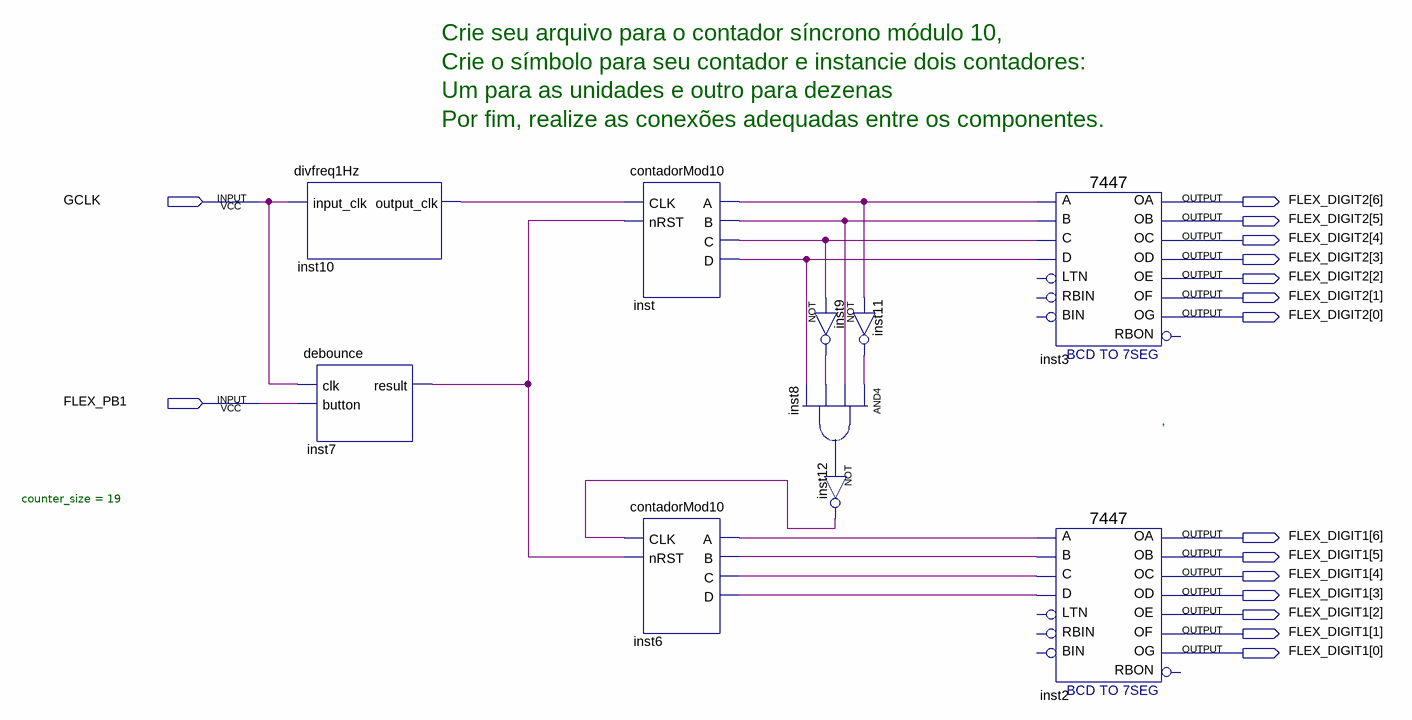
[diagram p0: schematic sheet]
// Quartus schematic Contadores.bdf as structural Verilog: 10 symbols, 16 pins
module Contadores (
  input  GCLK,
  input  FLEX_PB1,
  output [6:0] FLEX_DIGIT2,
  output [6:0] FLEX_DIGIT1
);

  wire inst6_a, inst6_b, inst6_c, inst6_d, inst7_result, inst8_out, inst9_out, inst10_output_clk, inst11_out,
       inst12_out, inst_a, inst_b, inst_c, inst_d;

  divfreq1Hz inst10 (.input_clk(GCLK), .output_clk(inst10_output_clk));
  debounce #(.counter_size(19)) inst7 (.clk(GCLK), .button(FLEX_PB1), .result(inst7_result));
  contadorMod10 inst (.CLK(inst10_output_clk), .nRST(inst7_result), .A(inst_a), .B(inst_b), .C(inst_c), .D(inst_d));
  contadorMod10 inst6 (.CLK(inst12_out), .nRST(inst7_result), .A(inst6_a), .B(inst6_b), .C(inst6_c), .D(inst6_d));
  not inst9 (inst9_out, inst_c);
  and inst8 (inst8_out, inst11_out, inst_b, inst9_out, inst_d);
  not inst12 (inst12_out, inst8_out);
  not inst11 (inst11_out, inst_a);
  \7447  inst3 (
    .B(inst_b), .C(inst_c), .D(inst_d), .A(inst_a), .OB(FLEX_DIGIT2[5]), .OC(FLEX_DIGIT2[4]),
    .OE(FLEX_DIGIT2[2]), .OD(FLEX_DIGIT2[3]), .OF(FLEX_DIGIT2[1]), .OG(FLEX_DIGIT2[0]), .OA(FLEX_DIGIT2[6]));  // open: LTN, RBIN, BIN, RBON
  \7447  inst2 (
    .B(inst6_b), .C(inst6_c), .D(inst6_d), .A(inst6_a), .OB(FLEX_DIGIT1[5]), .OC(FLEX_DIGIT1[4]),
    .OE(FLEX_DIGIT1[2]), .OD(FLEX_DIGIT1[3]), .OF(FLEX_DIGIT1[1]), .OG(FLEX_DIGIT1[0]), .OA(FLEX_DIGIT1[6]));  // open: LTN, RBIN, BIN, RBON

  // Notes on the sheet:
  //   Crie seu arquivo para o contador síncrono módulo 10,
  //   Crie o símbolo para seu contador e instancie dois contadores:
  //   Um para as unidades e outro para dezenas
  //   Por fim, realize as conexões adequadas entre os componentes.
  //   ,
endmodule
